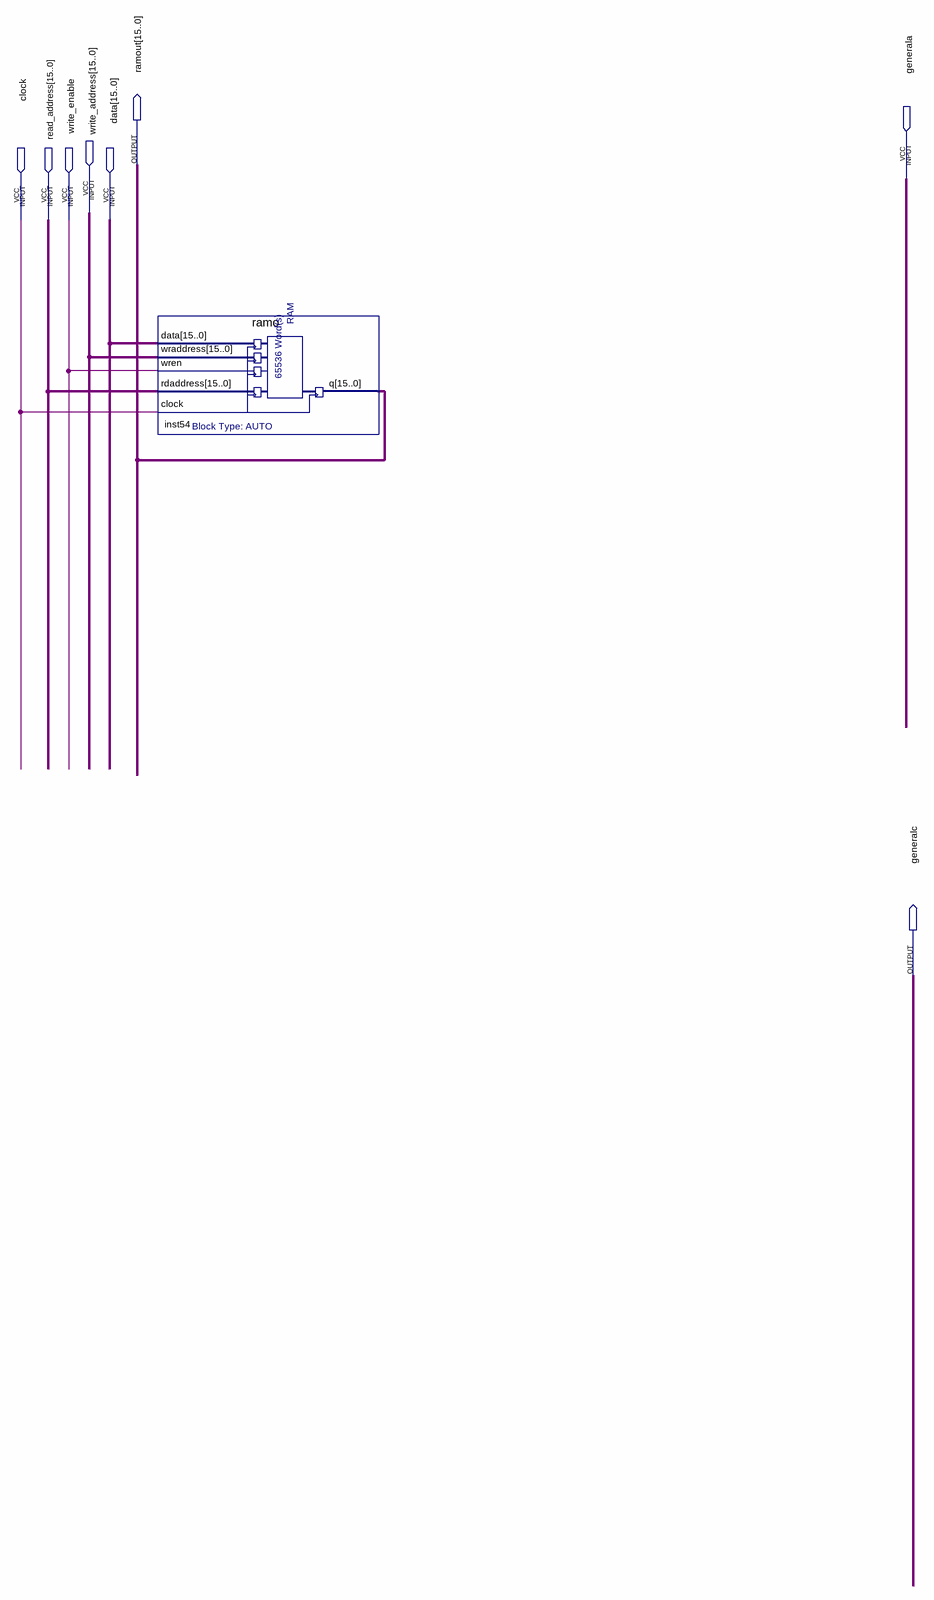
[diagram p0: schematic sheet]
// Quartus schematic ram_mod.bdf as structural Verilog: 1 symbols, 8 pins
module ram_mod (
  input  generala,
  input  [15:0] write_address,
  input  clock,
  input  [15:0] read_address,
  input  write_enable,
  input  [15:0] data,
  output [15:0] ramout,
  output generalc
);

  ramo inst54 (
    .data(data), .wraddress(write_address), .wren(write_enable), .rdaddress(read_address), .clock(clock),
    .q(ramout));
endmodule
